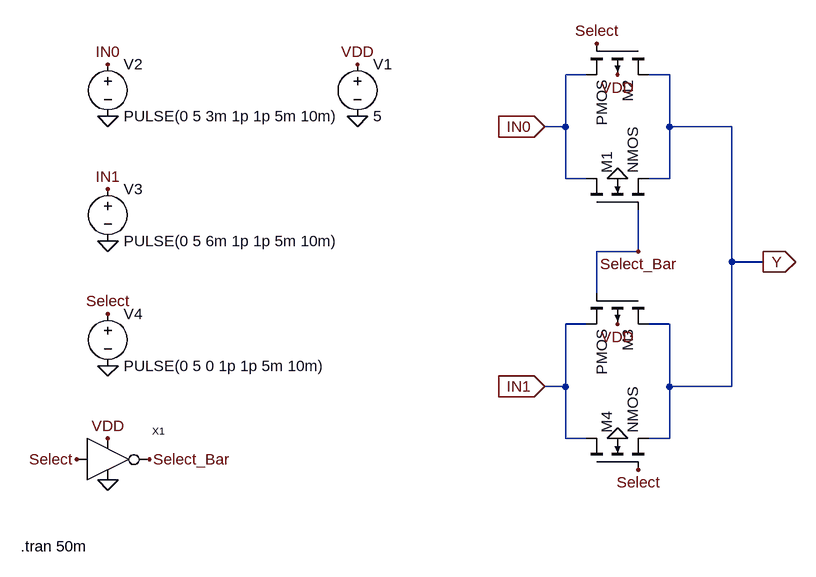
[diagram p0: schematic MUX_TG_TestCircuit.asc]
MUX_TG_TestCircuit.asc, the LTspice schematic file:
Version 4
SHEET 1 880 680
WIRE 16 -192 -16 -192
WIRE 144 -192 112 -192
WIRE -16 -112 -16 -192
WIRE -16 -112 -48 -112
WIRE 144 -112 144 -192
WIRE 240 -112 144 -112
WIRE -16 -32 -16 -112
WIRE 16 -32 -16 -32
WIRE 144 -32 144 -112
WIRE 144 -32 112 -32
WIRE 96 80 96 16
WIRE 96 80 32 80
WIRE 240 96 240 -112
WIRE 288 96 240 96
WIRE 32 144 32 80
WIRE 16 192 -16 192
WIRE 144 192 112 192
WIRE -16 288 -16 192
WIRE -16 288 -48 288
WIRE 144 288 144 192
WIRE 240 288 240 96
WIRE 240 288 144 288
WIRE -16 368 -16 288
WIRE 16 368 -16 368
WIRE 144 368 144 288
WIRE 144 368 112 368
FLAG 96 80 Select_Bar
FLAG 32 -240 Select
FLAG 96 416 Select
FLAG 64 -32 0
FLAG 64 368 0
FLAG 64 -192 VDD
FLAG 64 192 VDD
FLAG 288 96 Y
IOPIN 288 96 Out
FLAG -48 288 IN1
IOPIN -48 288 In
FLAG -48 -112 IN0
IOPIN -48 -112 In
FLAG -336 -208 VDD
FLAG -720 -208 IN0
FLAG -720 -16 IN1
FLAG -720 176 Select
FLAG -768 400 Select
FLAG -656 400 Select_Bar
FLAG -720 368 VDD
FLAG -720 432 0
FLAG -720 -128 0
FLAG -336 -128 0
FLAG -720 64 0
FLAG -720 256 0
SYMBOL nmos4 16 16 R270
SYMATTR InstName M1
SYMBOL pmos4 112 -240 R90
SYMATTR InstName M2
SYMBOL pmos4 112 144 R90
SYMATTR InstName M3
SYMBOL nmos4 16 416 R270
SYMATTR InstName M4
SYMBOL voltage -336 -224 R0
WINDOW 123 0 0 Left 0
WINDOW 39 0 0 Left 0
SYMATTR InstName V1
SYMATTR Value 5
SYMBOL voltage -720 -224 R0
WINDOW 123 0 0 Left 0
WINDOW 39 0 0 Left 0
SYMATTR InstName V2
SYMATTR Value PULSE(0 5 3m 1p 1p 5m 10m)
SYMBOL voltage -720 -32 R0
SYMATTR InstName V3
SYMATTR Value PULSE(0 5 6m 1p 1p 5m 10m)
SYMBOL voltage -720 160 R0
SYMATTR InstName V4
SYMATTR Value PULSE(0 5 0 1p 1p 5m 10m)
SYMBOL CMOS_Inverter -752 432 R0
SYMATTR InstName X1
TEXT -854 534 Left 2 !.tran 50m

The netlist it stands for:
* MUX_TG_TestCircuit.asc
M1 IN0 Select_Bar Y 0 NMOS
M2 Y Select IN0 VDD PMOS
M3 Y Select_Bar IN1 VDD PMOS
M4 IN1 Select Y 0 NMOS
V1 VDD 0 5
V2 IN0 0 PULSE(0 5 3m 1p 1p 5m 10m)
V3 IN1 0 PULSE(0 5 6m 1p 1p 5m 10m)
V4 Select 0 PULSE(0 5 0 1p 1p 5m 10m)
XX1 VDD 0 Select Select_Bar CMOS_Inverter  ; pins VPOS VNEG VIN VOUT
.model NMOS NMOS
.model PMOS PMOS
.lib standard.mos
.tran 50m
.backanno
.end